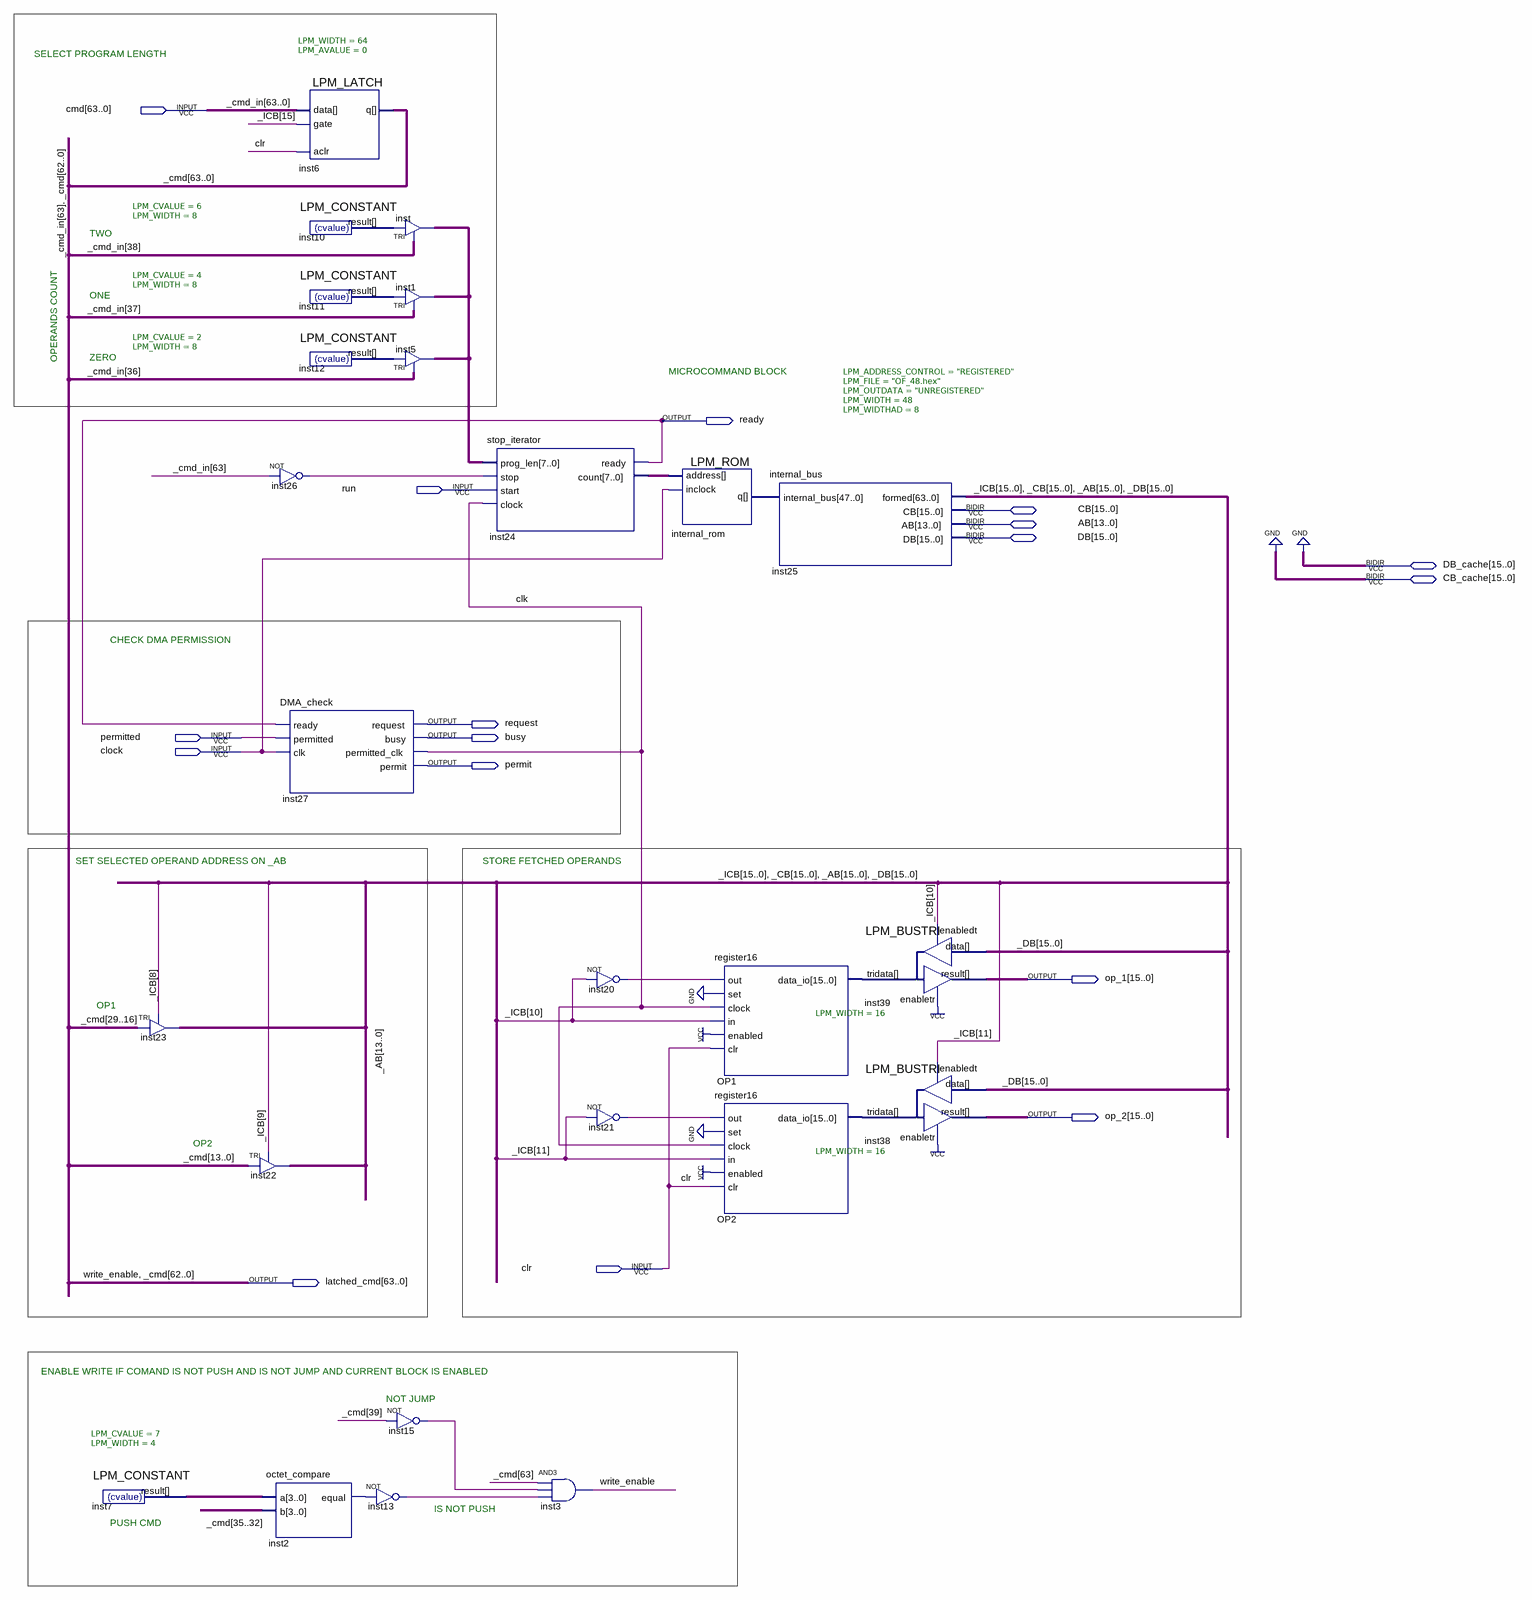
[diagram p0: schematic sheet]
// Quartus schematic OF.bdf as structural Verilog: 25 symbols, 17 pins
module OF (
  input  [63:0] cmd,
  input  run,
  input  permitted,
  input  clock,
  input  clr,
  inout  [15:0] CB,
  inout  [13:0] AB,
  inout  [15:0] DB,
  inout  [15:0] DB_cache,
  inout  [15:0] CB_cache,
  output ready,
  output request,
  output busy,
  output permit,
  output [15:0] op_1,
  output [15:0] op_2,
  output [63:0] latched_cmd
);

  wire clk, inst2_equal, inst13_out, inst15_out, inst20_out, inst21_out, inst26_out;
  wire [3:0] inst7_result;
  wire [7:0] inst10_result, inst11_result, inst12_result, inst24_count, inst_out;
  wire [15:0] _AB, _CB, _DB, _ICB, OP1_data_io, OP2_data_io;
  wire [47:0] internal_rom_q;
  wire [63:63] _cmd;

  LPM_CONSTANT #(.LPM_CVALUE(7), .LPM_WIDTH(4)) inst7 (.result(inst7_result));
  TRI inst23[63:0] (.IN(latched_cmd[29:16]), .OE(_ICB[8]), .OUT({_ICB, _CB, _AB, _DB}));
  not inst26 (inst26_out, cmd[63]);
  DMA_check inst27 (
    .ready(ready), .permitted(permitted), .clk(clock), .request(request), .busy(busy), .permitted_clk(clk),
    .permit(permit));
  TRI inst22[13:0] (.IN(latched_cmd[13:0]), .OE(_ICB[9]), .OUT(_AB[13:0]));
  octet_compare inst2 (.a(inst7_result), .b(latched_cmd[35:32]), .equal(inst2_equal));
  LPM_LATCH #(.LPM_WIDTH(64), .LPM_AVALUE(0)) inst6 (
    .aclr(clr), .data(cmd), .gate(_ICB[15]), .q({_cmd[63], latched_cmd[62:0]}));
  LPM_CONSTANT #(.LPM_CVALUE(6), .LPM_WIDTH(8)) inst10 (.result(inst10_result));
  LPM_CONSTANT #(.LPM_CVALUE(4), .LPM_WIDTH(8)) inst11 (.result(inst11_result));
  LPM_CONSTANT #(.LPM_CVALUE(2), .LPM_WIDTH(8)) inst12 (.result(inst12_result));
  TRI inst[7:0] (.IN(inst10_result), .OE(cmd[38]), .OUT(inst_out));
  TRI inst1[7:0] (.IN(inst11_result), .OE(cmd[37]), .OUT(inst_out));
  TRI inst5[7:0] (.IN(inst12_result), .OE(cmd[36]), .OUT(inst_out));
  not inst15 (inst15_out, latched_cmd[39]);
  not inst13 (inst13_out, inst2_equal);
  stop_iterator inst24 (
    .prog_len(inst_out), .stop(inst26_out), .start(run), .clock(clk), .ready(ready), .count(inst24_count));
  and inst3 (latched_cmd[63], _cmd[63], inst15_out, inst13_out);
  not inst20 (inst20_out, _ICB[10]);
  not inst21 (inst21_out, _ICB[11]);
  LPM_ROM #(.LPM_ADDRESS_CONTROL("REGISTERED"), .LPM_FILE("OF_48.hex"), .LPM_OUTDATA("UNREGISTERED"), .LPM_WIDTH(48), .LPM_WIDTHAD(8)) internal_rom (
    .address(inst24_count), .inclock(clock), .q(internal_rom_q));
  register16 OP1 (
    .out(inst20_out), .set(1'b0), .clock(clk), .in(_ICB[10]), .enabled(1'b1), .clr(clr), .data_io(OP1_data_io));
  register16 OP2 (
    .out(inst21_out), .set(1'b0), .clock(clk), .in(_ICB[11]), .enabled(1'b1), .clr(clr), .data_io(OP2_data_io));
  internal_bus inst25 (.internal_bus(internal_rom_q), .formed({_ICB, _CB, _AB, _DB}), .CB(CB), .AB(AB), .DB(DB));
  LPM_BUSTRI #(.LPM_WIDTH(16)) inst39 (
    .data(_DB), .enabledt(_ICB[10]), .enabletr(1'b1), .result(op_1), .tridata(OP1_data_io));
  LPM_BUSTRI #(.LPM_WIDTH(16)) inst38 (
    .data(_DB), .enabledt(_ICB[11]), .enabletr(1'b1), .result(op_2), .tridata(OP2_data_io));
  // also tied to GND on the sheet: {CB_cache[0], CB_cache[1], CB_cache[2], CB_cache[3], CB_cache[4], CB_cache[5], CB_cache[6], CB_cache[7], CB_cache[8], CB_cache[9], CB_cache[10], CB_cache[11], CB_cache[12], CB_cache[13], CB_cache[14], CB_cache[15], DB_cache[0], DB_cache[1], DB_cache[2], DB_cache[3], DB_cache[4], DB_cache[5], DB_cache[6], DB_cache[7], DB_cache[8], DB_cache[9], DB_cache[10], DB_cache[11], DB_cache[12], DB_cache[13], DB_cache[14], DB_cache[15]}

  // Other names for the same wires on the sheet: _cmd[62:0] = latched_cmd[62:0]; _cmd_in[63:0] = cmd;
  //   write_enable = latched_cmd[63]

  // Notes on the sheet:
  //   SELECT PROGRAM LENGTH
  //   TWO
  //   OPERANDS COUNT
  //   ONE
  //   ZERO
  //   MICROCOMMAND BLOCK
  //   CHECK DMA PERMISSION
  //   SET SELECTED OPERAND ADDRESS ON _AB
  //   STORE FETCHED OPERANDS
  //   OP1
  //   OP2
  //   ENABLE WRITE IF COMAND IS NOT PUSH AND IS NOT JUMP AND CURRENT BLOCK IS ENABLED
  //   NOT JUMP
  //   IS NOT PUSH
  //   PUSH CMD
endmodule
